# EAGLE schematic openmv-mp (EAGLE 9.1.2)
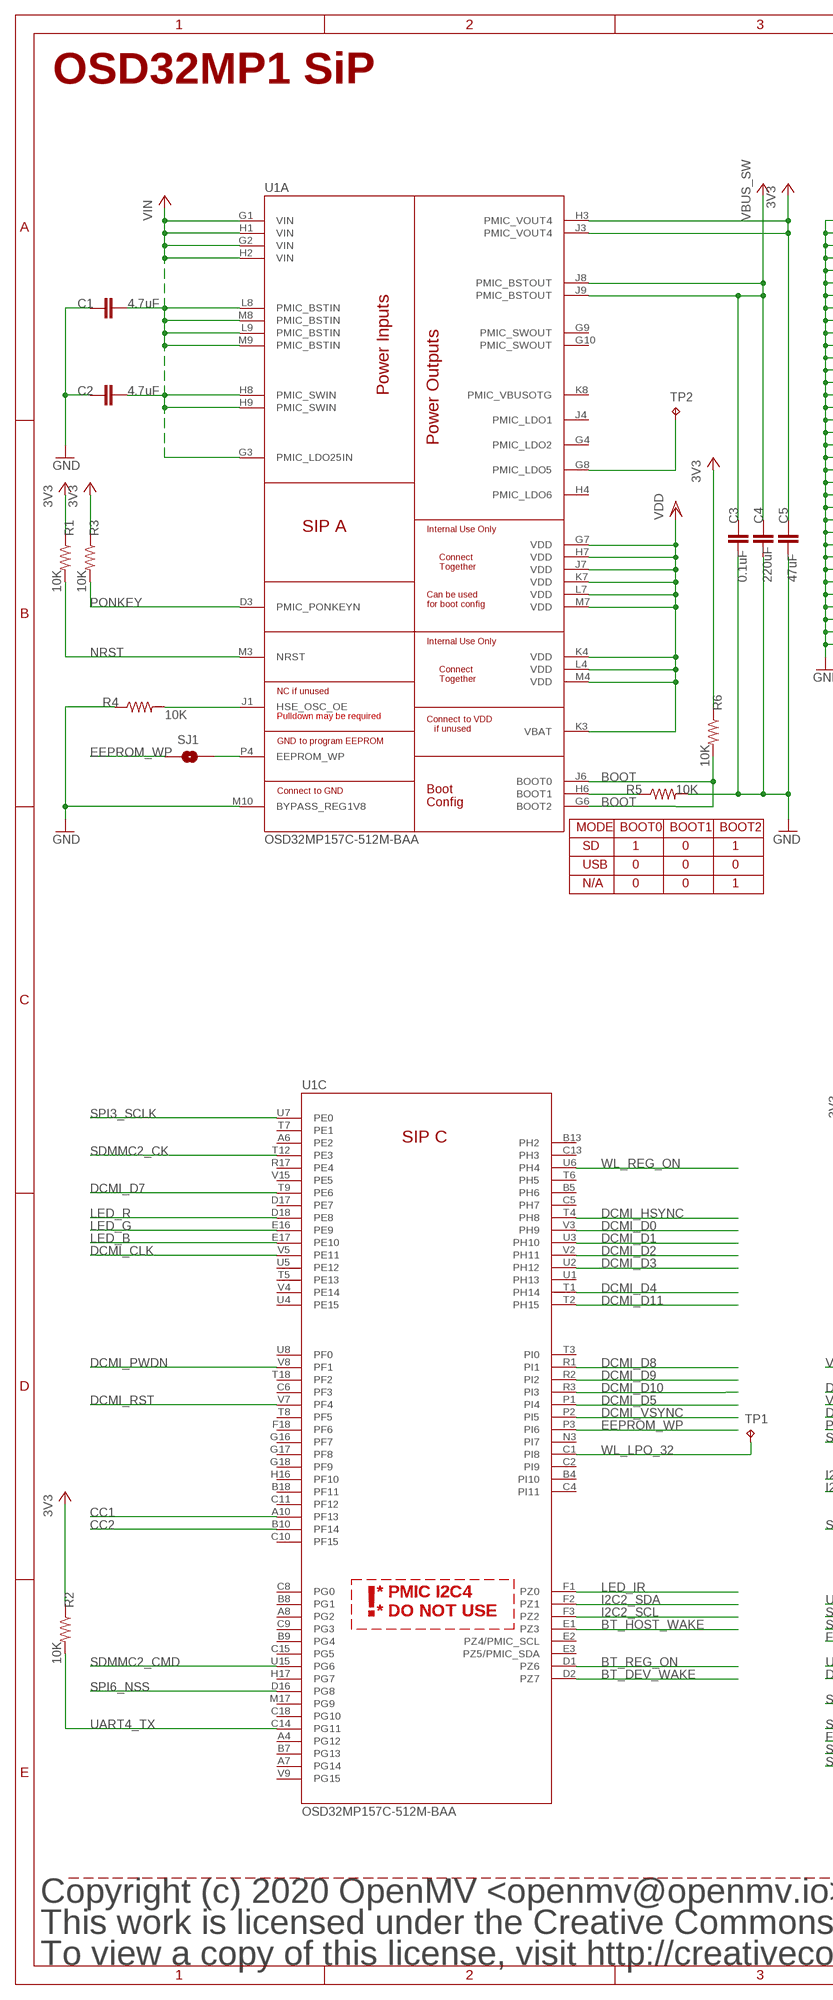
[diagram p0: schematic, sheet 1, part 1 of 2]
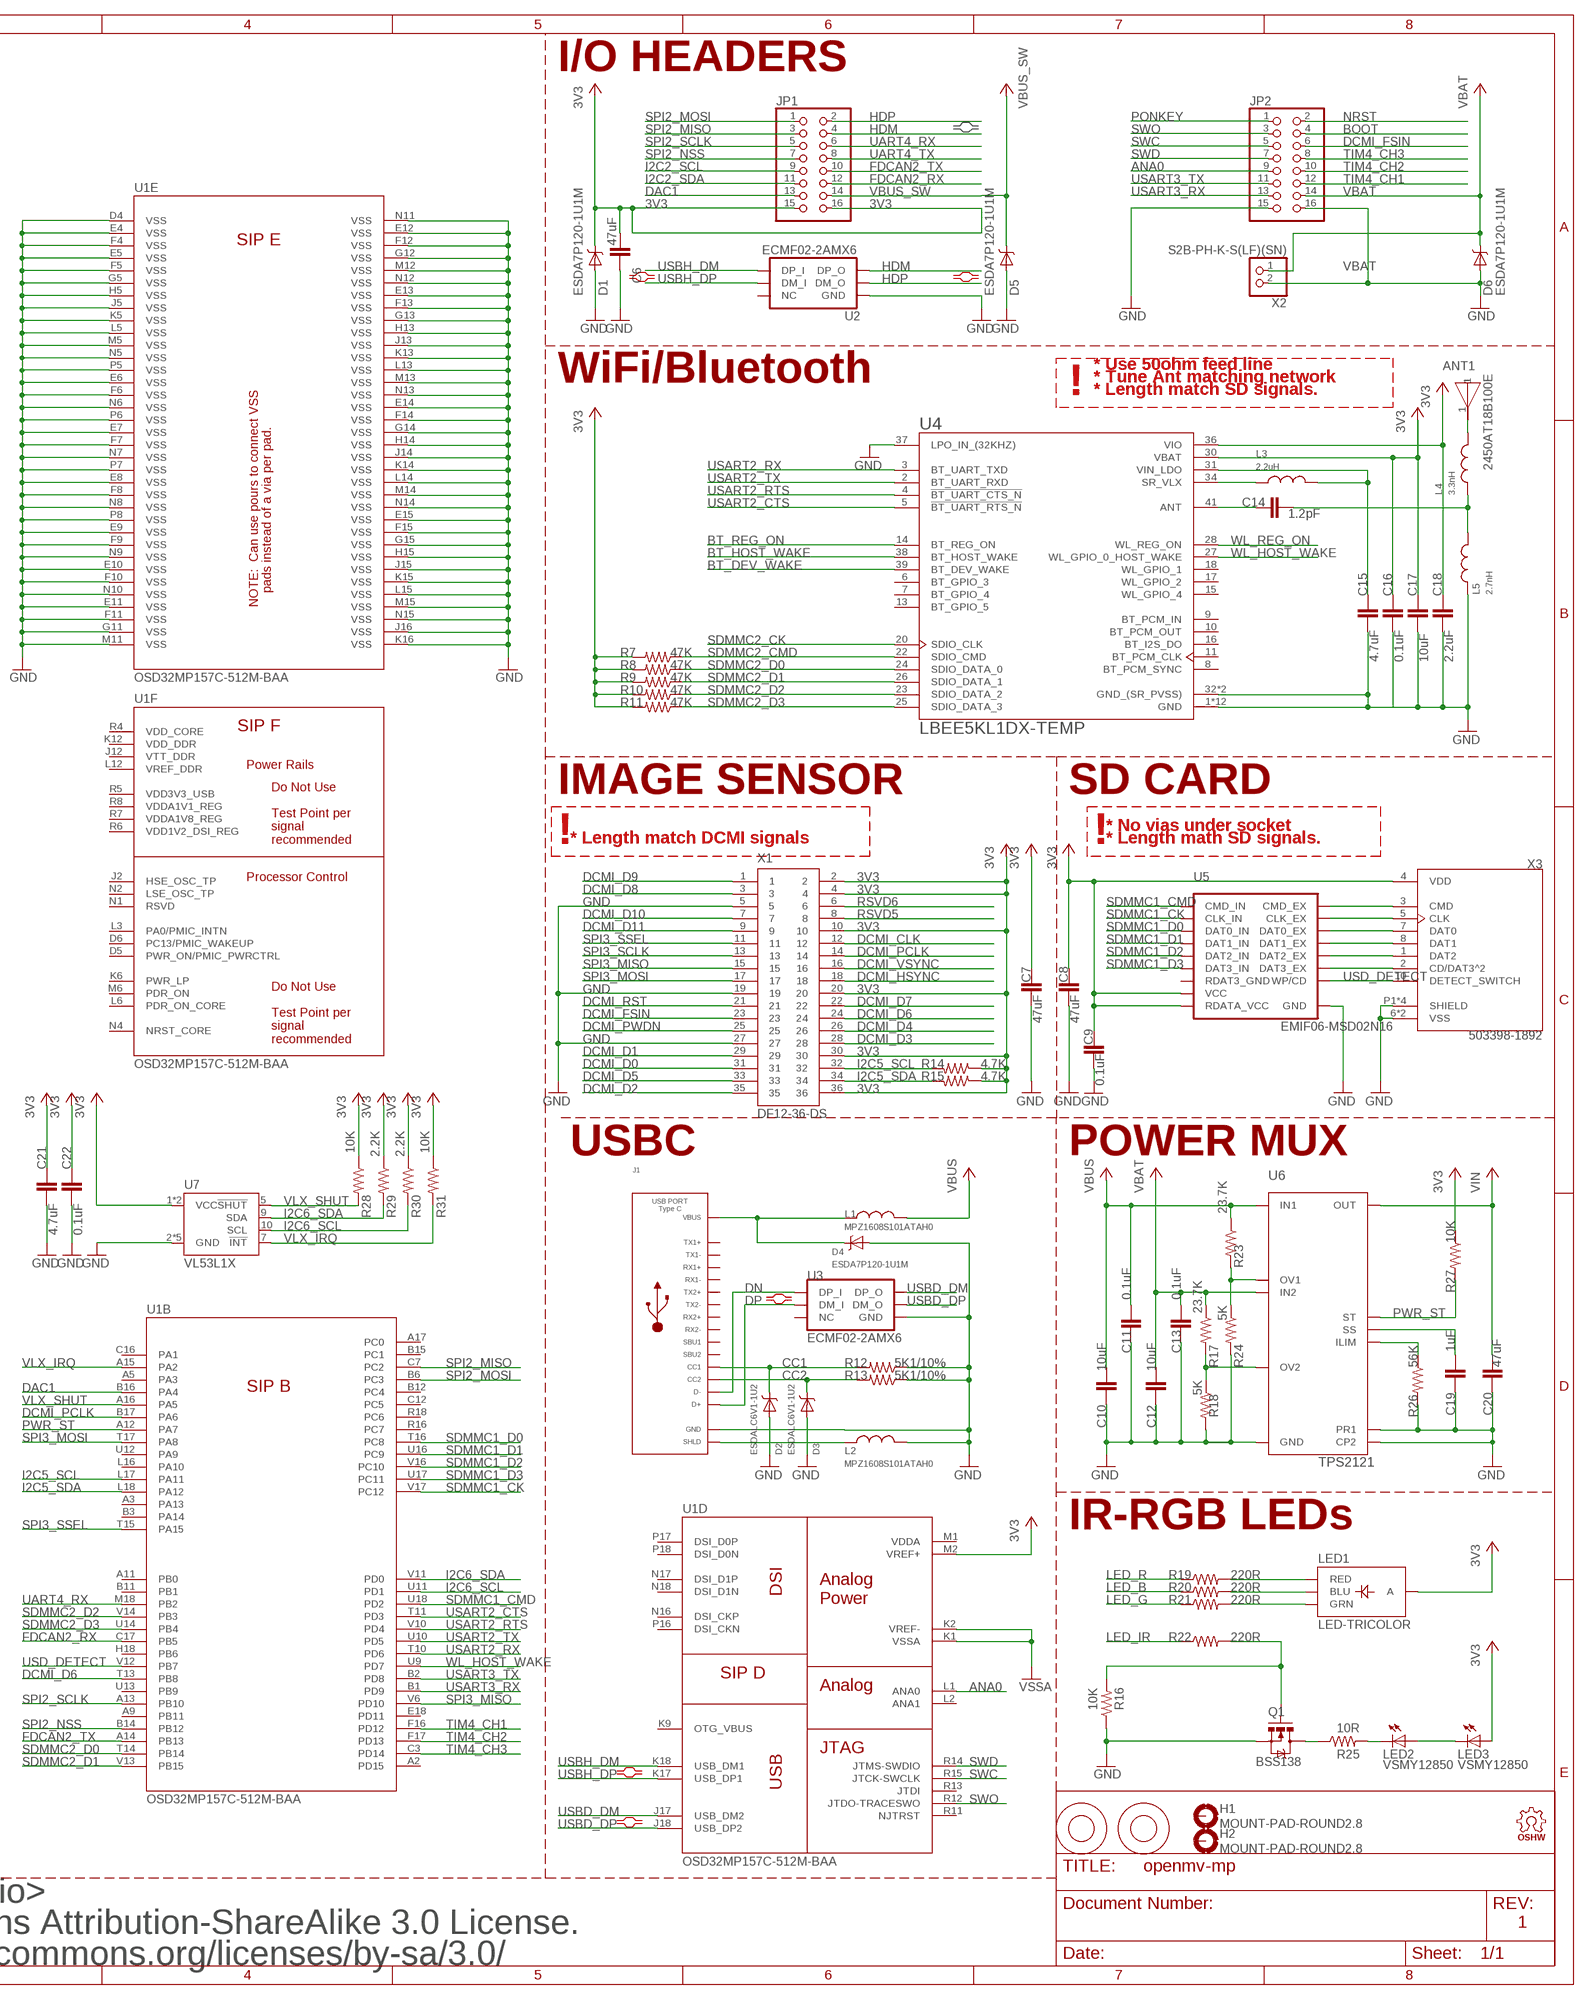
[diagram p1: schematic, sheet 1, part 2 of 2]

## Parts
ANT1  2450AT18B100E  [ANT_2450AT18B100E]
C1  4.7uF  CAP0402-CAP  [0402-CAP]
C2  4.7uF  CAP0402-CAP  [0402-CAP]
C3  0.1uF  CAP0402-CAP  [0402-CAP]
C4  220uF  CAP1206  [1206]
C5  47uF  CAP0805  [0805]
C6  47uF  CAP0805  [0805]
C7  47uF  CAP0805  [0805]
C8  47uF  CAP0805  [0805]
C9  0.1uF  CAP0402-CAP  [0402-CAP]
C10  10uF  CAP0402-CAP  [0402-CAP]
C11  0.1uF  CAP0402-CAP  [0402-CAP]
C12  10uF  CAP0402-CAP  [0402-CAP]
C13  0.1uF  CAP0402-CAP  [0402-CAP]
C14  1.2pF  CAP0402-CAP  [0402-CAP]
C15  4.7uF  CAP0402-CAP  [0402-CAP]
C16  0.1uF  CAP0402-CAP  [0402-CAP]
C17  10uF  CAP0402-CAP  [0402-CAP]
C18  2.2uF  CAP0402-CAP  [0402-CAP]
C19  1uF  CAP0402-CAP  [0402-CAP]
C20  47uF  CAP0805  [0805]
C21  4.7uF  CAP0402-CAP  [0402-CAP]
C22  0.1uF  CAP0402-CAP  [0402-CAP]
D1  ESDA7P120-1U1M  [ST0603]
D2  ESDALC6V1-1U2  [ST0201]
D3  ESDALC6V1-1U2  [ST0201]
D4  ESDA7P120-1U1M  [ST0603]
D5  ESDA7P120-1U1M  [ST0603]
D6  ESDA7P120-1U1M  [ST0603]
H1  MOUNT-PAD-ROUND2.8  [2,8-PAD]
H2  MOUNT-PAD-ROUND2.8  [2,8-PAD]
J1  USB_TYPE-C_105450-0101  [105450-0101]
JP1  PINHD-2X8  [2X08]
JP2  PINHD-2X8  [2X08]
L1  MPZ1608S101ATAH0  INDUCTOR0402  [C0402]
L2  MPZ1608S101ATAH0  INDUCTOR0402  [C0402]
L3  2.2uH  INDUCTOR0603  [0603]
L4  3.3nH  INDUCTOR0402  [C0402]
L5  2.7nH  INDUCTOR0402  [C0402]
LED1  LED-TRICOLOR  [LED-TRICOLOR-SMD-MF]
LED2  VSMY12850  LED1206  [LED-1206]
LED3  VSMY12850  LED1206  [LED-1206]
LOGO1  OSHW_LOGO_FILLX0100-NT  [OSHW_FILLX100_NOTEXT]
M1  9774030243R  9774030151R  [9774030151R]
M2  9774030243R  9774030151R  [9774030151R]
Q1  BSS138  MOSFET-NCHANNELSMD  [SOT23-3]
R1  10K  RESISTOR0402-RES  [0402-RES]
R2  10K  RESISTOR0402-RES  [0402-RES]
R3  10K  RESISTOR0402-RES  [0402-RES]
R4  10K  RESISTOR0402-RES  [0402-RES]
R5  10K  RESISTOR0402-RES  [0402-RES]
R6  10K  RESISTOR0402-RES  [0402-RES]
R7  47K  RESISTOR0402-RES  [0402-RES]
R8  47K  RESISTOR0402-RES  [0402-RES]
R9  47K  RESISTOR0402-RES  [0402-RES]
R10  47K  RESISTOR0402-RES  [0402-RES]
R11  47K  RESISTOR0402-RES  [0402-RES]
R12  5K1/10%  RESISTOR0402-RES  [0402-RES]
R13  5K1/10%  RESISTOR0402-RES  [0402-RES]
R14  4.7K  RESISTOR0402-RES  [0402-RES]
R15  4.7K  RESISTOR0402-RES  [0402-RES]
R16  10K  RESISTOR0402-RES  [0402-RES]
R17  23.7K  RESISTOR0402-RES  [0402-RES]
R18  5K  RESISTOR0402-RES  [0402-RES]
R19  220R  RESISTOR0402-RES  [0402-RES]
R20  220R  RESISTOR0402-RES  [0402-RES]
R21  220R  RESISTOR0402-RES  [0402-RES]
R22  220R  RESISTOR0402-RES  [0402-RES]
R23  23.7K  RESISTOR0402-RES  [0402-RES]
R24  5K  RESISTOR0402-RES  [0402-RES]
R25  10R  RESISTOR0402-RES  [0402-RES]
R26  56K  RESISTOR0402-RES  [0402-RES]
R27  10K  RESISTOR0402-RES  [0402-RES]
R28  10K  RESISTOR0402-RES  [0402-RES]
R29  2.2K  RESISTOR0402-RES  [0402-RES]
R30  2.2K  RESISTOR0402-RES  [0402-RES]
R31  10K  RESISTOR0402-RES  [0402-RES]
SJ1  SOLDERJUMPERNO  [SJ_2S-NO]
TP1  TPTP10R  [TP10R]
TP2  TPTP10R  [TP10R]
U1  OSD32MP157C-512M-BAA  [OSD32MP15X-BGA-324]
U2  ECMF02-2AMX6  [QFN-6L]
U3  ECMF02-2AMX6  [QFN-6L]
U4  LBEE5KL1DX-TEMP  [XCVR_LBEE5KL1DX-TEMP]
U5  EMIF06-MSD02N16  [QFN3.5]
U6  TPS2121  [VQFN-HR]
U7  VL53L1X  VL53L1XSMD  [VL53L1X]
X1  DF12-36-DS  [DF12-36-DS]
X2  S2B-PH-K-S(LF)(SN)  JST_2PIN-THM-RA  [JST-PH-2-THM-RA]
X3  503398-1892  [MOLEX_503398-1892]

## Nets
3V3: C5.1 C6.1 C7.1 C8.1 C9.1 C16.1 C17.1 C18.1 C21.1 C22.1 D1.1(C) JP1.15 JP1.16 LED1.A LED3.A R1.1 R2.1 R3.1 R6.1 R7.2 R8.2 R9.2 R10.2 R11.2 R14.1 R15.1 R27.1 R28.1 R29.1 R30.1 R31.1 U1.H3(A:PMIC_VOUT4) U1.J3(A:PMIC_VOUT4) U1.M2(D:VREF+) U4.30(VBAT) U4.36(VIO) U5.P$15(VCC) U5.P$16(RDATA_VCC) U7.1(VCC) U7.11(VCC) X1.2 X1.4 X1.10 X1.20 X1.30 X1.36 X3.4(VDD)
ANA0: JP2.9 U1.L1(D:ANA0)
BOOT: JP2.4 R6.2 U1.G6(A:BOOT2) U1.J6(A:BOOT0)
BT_DEV_WAKE: U1.D2(C:PZ7) U4.39(BT_DEV_WAKE)
BT_HOST_WAKE: U1.E1(C:PZ3) U4.38(BT_HOST_WAKE)
BT_REG_ON: U1.D1(C:PZ6) U4.14(BT_REG_ON)
CC1: D2.1(C) J1.A5(CC1) R12.2 U1.A10(C:PF13)
CC2: D3.1(C) J1.B5(CC2) R13.2 U1.B10(C:PF14)
DAC1: JP1.13 U1.B16(B:PA4)
DCMI_CLK: U1.V5(C:PE11) X1.12
DCMI_D0: U1.V3(C:PH9) X1.31
DCMI_D1: U1.U3(C:PH10) X1.29
DCMI_D2: U1.V2(C:PH11) X1.35
DCMI_D3: U1.U2(C:PH12) X1.28
DCMI_D4: U1.T1(C:PH14) X1.26
DCMI_D5: U1.P1(C:PI4) X1.33
DCMI_D6: U1.T13(B:PB8) X1.24
DCMI_D7: U1.T9(C:PE6) X1.22
DCMI_D8: U1.R1(C:PI1) X1.3
DCMI_D9: U1.R2(C:PI2) X1.1
DCMI_D10: U1.R3(C:PI3) X1.7
DCMI_D11: U1.T2(C:PH15) X1.9
DCMI_FSIN: JP2.6 X1.23
DCMI_HSYNC: U1.T4(C:PH8) X1.18
DCMI_PCLK: U1.B17(B:PA6) X1.14
DCMI_PWDN: U1.V8(C:PF1) X1.25
DCMI_RST: U1.V7(C:PF4) X1.21
DCMI_VSYNC: U1.P2(C:PI5) X1.16
DN: J1.A7(D-) J1.B7(D-) U3.1(DP_I)
DP: J1.A6(D+) J1.B6(D+) U3.2(DM_I)
EEPROM_WP: SJ1.1 U1.P3(C:PI6)
FDCAN2_RX: JP1.12 U1.C17(B:PB5)
FDCAN2_TX: JP1.10 U1.A14(B:PB13)
GND: C1.1 C2.1 C3.2 C4.2 C5.2 C6.2 C7.2 C8.2 C9.2 C10.2 C11.2 C12.2 C13.2 C15.2 C16.2 C17.2 C18.2 C19.2 C20.2 C21.2 C22.2 D1.2(A) D2.2(A) D3.2(A) D4.2(A) D5.2(A) D6.2(A) J1.A1(GND) J1.A12(GND) J1.B1(GND) J1.B12(GND) JP2.15 JP2.16 L2.2 L5.1 Q1.2(S) R4.1 R5.2 R12.1 R13.1 R16.1 R18.2 R24.2 R26.2 U1.D4(E:VSS) U1.E4(E:VSS) U1.E5(E:VSS) U1.E6(E:VSS) U1.E7(E:VSS) U1.E8(E:VSS) U1.E9(E:VSS) U1.E10(E:VSS) U1.E11(E:VSS) U1.E12(E:VSS) U1.E13(E:VSS) U1.E14(E:VSS) U1.E15(E:VSS) U1.F4(E:VSS) U1.F5(E:VSS) U1.F6(E:VSS) U1.F7(E:VSS) U1.F8(E:VSS) U1.F9(E:VSS) U1.F10(E:VSS) U1.F11(E:VSS) U1.F12(E:VSS) U1.F13(E:VSS) U1.F14(E:VSS) U1.F15(E:VSS) U1.G5(E:VSS) U1.G11(E:VSS) U1.G12(E:VSS) U1.G13(E:VSS) U1.G14(E:VSS) U1.G15(E:VSS) U1.H5(E:VSS) U1.H13(E:VSS) U1.H14(E:VSS) U1.H15(E:VSS) U1.J5(E:VSS) U1.J13(E:VSS) U1.J14(E:VSS) U1.J15(E:VSS) U1.J16(E:VSS) U1.K5(E:VSS) U1.K13(E:VSS) U1.K14(E:VSS) U1.K15(E:VSS) U1.K16(E:VSS) U1.L5(E:VSS) U1.L13(E:VSS) U1.L14(E:VSS) U1.L15(E:VSS) U1.M5(E:VSS) U1.M10(A:BYPASS_REG1V8) U1.M11(E:VSS) U1.M12(E:VSS) U1.M13(E:VSS) U1.M14(E:VSS) U1.M15(E:VSS) U1.N5(E:VSS) U1.N6(E:VSS) U1.N7(E:VSS) U1.N8(E:VSS) U1.N9(E:VSS) U1.N10(E:VSS) U1.N11(E:VSS) U1.N12(E:VSS) U1.N13(E:VSS) U1.N14(E:VSS) U1.N15(E:VSS) U1.P5(E:VSS) U1.P6(E:VSS) U1.P7(E:VSS) U1.P8(E:VSS) U2.3(GND) U3.3(GND) U4.1(GND) U4.12(GND) U4.19(GND) U4.21(GND) U4.29(GND) U4.32(GND_(SR_PVSS)) U4.33(GND_(SR_PVSS)) U4.35(GND) U4.37(LPO_IN_(32KHZ)) U4.40(GND) U4.42(GND) U4.43(GND) U4.44(GND) U4.45(GND) U4.46(GND) U5.GND U6.P$3(CP2) U6.P$6(PR1) U6.P$12(GND) U7.2(GND) U7.3(GND) U7.4(GND) U7.6(GND) U7.12(GND) X1.5 X1.19 X1.27 X2.2 X3.6(VSS) X3.9(VSS) X3.P1(SHIELD) X3.P2(SHIELD) X3.P3(SHIELD) X3.P4(SHIELD)
HDM: JP1.4 U2.6(DP_O)
HDP: JP1.2 U2.5(DM_O)
I2C2_SCL: JP1.9 U1.F3(C:PZ2)
I2C2_SDA: JP1.11 U1.F2(C:PZ1)
I2C5_SCL: R14.2 U1.L17(B:PA11) X1.32
I2C5_SDA: R15.2 U1.L18(B:PA12) X1.34
I2C6_SCL: R30.2 U1.U11(B:PD1) U7.10(SCL)
I2C6_SDA: R29.2 U1.V11(B:PD0) U7.9(SDA)
LED_B: R20.1 U1.E17(C:PE10)
LED_G: R21.1 U1.E16(C:PE9)
LED_IR: R22.1 U1.F1(C:PZ0)
LED_R: R19.1 U1.D18(C:PE8)
N$2: R4.2 U1.J1(A:HSE_OSC_OE)
N$4: J1.S_T1(SHLD) J1.S_T2(SHLD) J1.S_T3(SHLD) J1.S_T4(SHLD) L2.1
N$5: Q1.1(G) R16.2 R22.2
N$6: LED1.B(BLU) R20.2
N$7: SJ1.2 U1.P4(A:EEPROM_WP)
N$8: LED1.R(RED) R19.2
N$9: LED1.G(GRN) R21.2
N$10: LED2.C R25.2
N$11: TP2.TP U1.G8(A:PMIC_LDO5)
N$12: U5.P$13(DAT3_EX) X3.2(CD/DAT3^2)
N$13: U5.P$14(DAT2_EX) X3.1(DAT2)
N$14: Q1.3(D) R25.1
N$17: LED2.A LED3.C
N$30: U5.P$9(DAT1_EX) X3.8(DAT1)
N$31: U5.P$10(DAT0_EX) X3.7(DAT0)
N$32: U5.P$11(CLK_EX) X3.5(CLK)
N$33: U5.P$12(CMD_EX) X3.3(CMD)
N$34: D4.1(C) J1.A4(VBUS) J1.A9(VBUS) J1.B4(VBUS) J1.B9(VBUS) L1.1
N$36: R5.1 U1.H6(A:BOOT1)
N$39: R23.2 R24.1 U6.P$5(OV1)
N$40: C19.1 U6.P$11(SS)
N$41: R17.2 R18.1 U6.P$4(OV2)
N$42: R26.1 U6.P$10(ILIM)
N$44: C14.1 L4.1 L5.2
N$45: ANT1.1 L4.2
N$46: C14.2 U4.41(ANT)
N$47: C15.1 L3.2 U4.31(VIN_LDO)
N$48: L3.1 U4.34(SR_VLX)
NRST: JP2.2 R1.2 U1.M3(A:NRST)
PONKEY: JP2.1 R3.2 U1.D3(A:PMIC_PONKEYN)
PWR_ST: R27.2 U1.A12(B:PA7) U6.P$9(ST)
RSVD5: X1.8
RSVD6: X1.6
SDMMC1_CK: U1.V17(B:PC12) U5.P$6(CLK_IN)
SDMMC1_CMD: U1.U18(B:PD2) U5.P$5(CMD_IN)
SDMMC1_D0: U1.T16(B:PC8) U5.P$7(DAT0_IN)
SDMMC1_D1: U1.U16(B:PC9) U5.P$8(DAT1_IN)
SDMMC1_D2: U1.V16(B:PC10) U5.P$3(DAT2_IN)
SDMMC1_D3: U1.U17(B:PC11) U5.P$4(DAT3_IN)
SDMMC2_CK: U1.T12(C:PE3) U4.20(SDIO_CLK)
SDMMC2_CMD: R7.1 U1.U15(C:PG6) U4.22(SDIO_CMD)
SDMMC2_D0: R8.1 U1.T14(B:PB14) U4.24(SDIO_DATA_0)
SDMMC2_D1: R9.1 U1.V13(B:PB15) U4.26(SDIO_DATA_1)
SDMMC2_D2: R10.1 U1.V14(B:PB3) U4.23(SDIO_DATA_2)
SDMMC2_D3: R11.1 U1.U14(B:PB4) U4.25(SDIO_DATA_3)
SPI2_MISO: JP1.3 U1.C7(B:PC2)
SPI2_MOSI: JP1.1 U1.B6(B:PC3)
SPI2_NSS: JP1.7 U1.B14(B:PB12)
SPI2_SCLK: JP1.5 U1.A13(B:PB10)
SPI3_MISO: U1.V6(B:PD10) X1.15
SPI3_MOSI: U1.T17(B:PA8) X1.17
SPI3_SCLK: U1.U7(C:PE0) X1.13
SPI3_SSEL: U1.T15(B:PA15) X1.11
SPI6_NSS: U1.D16(C:PG8)
SWC: JP2.5 U1.R15(D:JTCK-SWCLK)
SWD: JP2.7 U1.R14(D:JTMS-SWDIO)
SWO: JP2.3 U1.R12(D:JTDO-TRACESWO)
TIM4_CH1: JP2.12 U1.F16(B:PD12)
TIM4_CH2: JP2.10 U1.F17(B:PD13)
TIM4_CH3: JP2.8 U1.C3(B:PD14)
UART4_RX: JP1.6 U1.M18(B:PB2)
UART4_TX: JP1.8 R2.2 U1.C14(C:PG11)
USART2_CTS: U1.T11(B:PD3) U4.5(!BT_UART_RTS_N)
USART2_RTS: U1.V10(B:PD4) U4.4(!BT_UART_CTS_N)
USART2_RX: U1.T10(B:PD6) U4.3(BT_UART_TXD)
USART2_TX: U1.U10(B:PD5) U4.2(BT_UART_RXD)
USART3_RX: JP2.13 U1.B1(B:PD9)
USART3_TX: JP2.11 U1.B2(B:PD8)
USBD_DM: U1.J17(D:USB_DM2) U3.6(DP_O)
USBD_DP: U1.J18(D:USB_DP2) U3.5(DM_O)
USBH_DM: U1.K18(D:USB_DM1) U2.1(DP_I)
USBH_DP: U1.K17(D:USB_DP1) U2.2(DM_I)
USD_DETECT: U1.V12(B:PB7) U5.P$1(WP/CD) X3.10(DETECT_SWITCH)
VBAT: C12.1 C13.1 D6.1(C) JP2.14 R17.1 U6.P$2(IN2) X2.1
VBUS: C10.1 C11.1 L1.2 R23.1 U6.P$7(IN1)
VBUS_SW: C3.1 C4.1 D5.1(C) JP1.14 U1.J8(A:PMIC_BSTOUT) U1.J9(A:PMIC_BSTOUT)
VDD: U1.G7(A:VDD) U1.H7(A:VDD) U1.J7(A:VDD) U1.K3(A:VBAT) U1.K4(A:VDD) U1.K7(A:VDD) U1.L4(A:VDD) U1.L7(A:VDD) U1.M4(A:VDD) U1.M7(A:VDD)
VIN: C1.2 C2.2 C20.1 U1.G1(A:VIN) U1.G2(A:VIN) U1.G3(A:PMIC_LDO25IN) U1.H1(A:VIN) U1.H2(A:VIN) U1.H8(A:PMIC_SWIN) U1.H9(A:PMIC_SWIN) U1.L8(A:PMIC_BSTIN) U1.L9(A:PMIC_BSTIN) U1.M8(A:PMIC_BSTIN) U1.M9(A:PMIC_BSTIN) U6.P$1(OUT) U6.P$8(OUT)
VLX_IRQ: R31.2 U1.A15(B:PA2) U7.7(!INT)
VLX_SHUT: R28.2 U1.A16(B:PA5) U7.5(!SHUT)
VSSA: U1.K1(D:VSSA) U1.K2(D:VREF-)
WL_HOST_WAKE: U1.U9(B:PD7) U4.27(WL_GPIO_0_HOST_WAKE)
WL_LPO_32: TP1.TP U1.C1(C:PI8)
WL_REG_ON: U1.U6(C:PH4) U4.28(WL_REG_ON)
Unconnected: H1.B2,8(MOUNT) H2.B2,8(MOUNT) J1.A2(TX1+) J1.A3(TX1-) J1.A8(SBU1) J1.A10(RX2-) J1.A11(RX2+) J1.B2(TX2+) J1.B3(TX2-) J1.B8(SBU2) J1.B10(RX1-) J1.B11(RX1+) U1.A2(B:PD15) U1.A3(B:PA13) U1.A4(C:PG12) U1.A5(B:PA3) U1.A6(C:PE2) U1.A7(C:PG14) U1.A8(C:PG2) U1.A9(B:PB11) U1.A11(B:PB0) U1.A17(B:PC0) U1.B3(B:PA14) U1.B4(C:PI10) U1.B5(C:PH6) U1.B7(C:PG13) U1.B8(C:PG1) U1.B9(C:PG4) U1.B11(B:PB1) U1.B12(B:PC4) U1.B13(C:PH2) U1.B15(B:PC1) U1.B18(C:PF11) U1.C2(C:PI9) U1.C4(C:PI11) U1.C5(C:PH7) U1.C6(C:PF3) U1.C8(C:PG0) U1.C9(C:PG3) U1.C10(C:PF15) U1.C11(C:PF12) U1.C12(B:PC5) U1.C13(C:PH3) U1.C15(C:PG5) U1.C16(B:PA1) U1.C18(C:PG10) U1.D5(F:PWR_ON/PMIC_PWRCTRL) U1.D6(F:PC13/PMIC_WAKEUP) U1.D7(G:RSVD) U1.D8(G:RSVD) U1.D9(G:RSVD) U1.D10(G:RSVD) U1.D17(C:PE7) U1.E2(C:PZ4/PMIC_SCL) U1.E3(C:PZ5/PMIC_SDA) U1.E18(B:PD11) U1.F18(C:PF6) U1.G4(A:PMIC_LDO2) U1.G9(A:PMIC_SWOUT) U1.G10(A:PMIC_SWOUT) U1.G16(C:PF7) U1.G17(C:PF8) U1.G18(C:PF9) U1.H4(A:PMIC_LDO6) U1.H12(G:RSVD) U1.H16(C:PF10) U1.H17(C:PG7) U1.H18(B:PB6) U1.J2(F:HSE_OSC_TP) U1.J4(A:PMIC_LDO1) U1.J12(F:VTT_DDR) U1.K6(F:PWR_LP) U1.K8(A:PMIC_VBUSOTG) U1.K9(D:OTG_VBUS) U1.K12(F:VDD_DDR) U1.L2(D:ANA1) U1.L3(F:PA0/PMIC_INTN) U1.L6(F:PDR_ON_CORE) U1.L12(F:VREF_DDR) U1.L16(B:PA10) U1.M1(D:VDDA) U1.M6(F:PDR_ON) U1.M16(G:RSVD) U1.M17(C:PG9) U1.N1(F:RSVD) U1.N2(F:LSE_OSC_TP) U1.N3(C:PI7) U1.N4(F:NRST_CORE) U1.N16(D:DSI_CKP) U1.N17(D:DSI_D1P) U1.N18(D:DSI_D1N) U1.P9(G:RSVD) U1.P10(G:RSVD) U1.P16(D:DSI_CKN) U1.P17(D:DSI_D0P) U1.P18(D:DSI_D0N) U1.R4(F:VDD_CORE) U1.R5(F:VDD3V3_USB) U1.R6(F:VDD1V2_DSI_REG) U1.R7(F:VDDA1V8_REG) U1.R8(F:VDDA1V1_REG) U1.R9(G:RSVD) U1.R10(G:RSVD) U1.R11(D:NJTRST) U1.R13(D:JTDI) U1.R16(B:PC7) U1.R17(C:PE4) U1.R18(B:PC6) U1.T3(C:PI0) U1.T5(C:PE13) U1.T6(C:PH5) U1.T7(C:PE1) U1.T8(C:PF5) U1.T18(C:PF2) U1.U1(C:PH13) U1.U4(C:PE15) U1.U5(C:PE12) U1.U8(C:PF0) U1.U12(B:PA9) U1.U13(B:PB9) U1.V4(C:PE14) U1.V9(C:PG15) U1.V15(C:PE5) U2.4(NC) U3.4(NC) U4.6(BT_GPIO_3) U4.7(BT_GPIO_4) U4.8(BT_PCM_SYNC) U4.9(BT_PCM_IN) U4.10(BT_PCM_OUT) U4.11(BT_PCM_CLK) U4.13(BT_GPIO_5) U4.15(WL_GPIO_4) U4.16(BT_I2S_DO) U4.17(WL_GPIO_2) U4.18(WL_GPIO_1) U5.P$2(RDAT3_GND)

## Notes on the sheet
- OSD32MP1 SiP | I/O HEADERS
- * Use 50ohm feed line
- WiFi/Bluetooth | ! | * Tune Ant matching network
- * Length match SD signals.
- Pulldown may be required
- IMAGE SENSOR | SD CARD
- MODE | BOOT0 | BOOT1 | BOOT2 | * No vias under socket
- ! | * Length match DCMI signals | ! | * Length math SD signals.
- SD | 1 | 0 | 1
- USB | 0 | 0 | 0
- N/A | 0 | 0 | 1
- USBC | POWER MUX
- IR-RGB LEDs
- !
- * PMIC I2C4
  * DO NOT USE
- Copyright (c) 2020 OpenMV <openmv@openmv.io>
- 1
- This work is licensed under the Creative Commons Attribution-ShareAlike 3.0 License.
- To view a copy of this license, visit http://creativecommons.org/licenses/by-sa/3.0/

## Library data of the parts
ANT1 = 2450AT18B100E:2450AT18B100E: ANTENNA, CERAMIC, 2.45GHZ; Bandwidth: 100MHz; Frequency: 2.45GHz; Gain: -0.5dB; Impedance: 50ohm http://www.snapeda.com/parts/2450AT18B100E/Johanson/view-part/#; AVAILABILITY: Unavailable; DESCRIPTION: 2.4GHz Chip RF Antenna 2.4GHz ~ 2.5GHz 0.5dBi Solder Surface Mount; MF: Johanson Technology; MP: 2450AT18B100E; PACKAGE: None; PRICE: None
C1-C22 = sfe:CAP: Capacitor Standard 0603 ceramic capacitor, and 0.1" leaded capacitor.
D1 D4-D6 = esd:ESDA7P120-1U1M
D2 D3 = esd:ESDALC6V1-1U2
H1 H2 = holes:MOUNT-PAD-ROUND: MOUNTING PAD, round
J1 = PP_Connectors:USB_TYPE-C; POPULATE: 1
JP1 JP2 = pinhead:PINHD-2X8: PIN HEADER
L1-L5 = sfe:INDUCTOR: Inductors Basic Inductor/Choke - 0603 and 1206. Footprints are not proven and vary greatly between part numbers.
LED1 = sfe:LED-TRICOLOR: Tri-Color LED SMD Proven layout and schematic for triple color LED in SMD package - common anode. Spark Fun Electronics SKU : COM-07844
LED2 LED3 = sfe:LED: LEDs Standard schematic elements and footprints for 5mm, 3mm, 1206, and 0603 sized LEDs. 5mm - Spark Fun Electronics SKU : COM-00529 (and others)
LOGO1 = iofault:OSHW_LOGO_FILL
M1 M2 = STANDOFFS:9774030151R
Q1 = sfe:MOSFET-NCHANNEL
R1-R31 = sfe:RESISTOR: Resistor Basic schematic elements and footprints for 0603, 1206, and PTH resistors.
SJ1 = sfe:SOLDERJUMPER: Solder Jumper Standard SMD solder jumper. Used to automate production. Two varients : Normally Open and Normally Closed are the same, but have different paste layers. NC will have a large amount of paste and should jumper during reflow.
TP1 TP2 = testpad:TP: Test pad
U1 = Octavo-Systems:OSD32MP157C-512M-BAA: Octavo Systems LLC OSD32MP15x Family SiP: 18mm x 18mm, 1mm pitch 302 pin BGA contains STM32MP157C, 512MB DDR3, STPMIC1A, 4kB EEPROM, MEMS oscillators (24MHz and 32kHz) and passives. Commerical Temperature (case): 0C to 85C.
U2 U3 = esd:ECMF02-2AMX6
U4 = LBEE5KL1DX-TEMP:LBEE5KL1DX-TEMP: Broadcom Chipset for 802.11b/g/n + Bluetooth 4.1/EDR; AVAILABILITY: Unavailable; DESCRIPTION: WICED Transceiver; 802.11 b/g/n _Wi-Fi, WiFi, WLAN_, Bluetooth® Smart Ready 4.x Dual Mode For Use With BCM4343W, i.MX 6; MF: Murata Electronics; MP: LBEE5KL1DX-TEMP; PACKAGE: None; PRICE: None
U5 = esd:EMIF06-MSD02N16
U6 = mux:TPS2121
U7 = SparkFun-Sensors:VL53L1X: STMicroelectronics VL53L1X - 400 cm IR Laser ToF Sensor VL53L1X is a state-of-the-art ToF laser-ranging sensor, enhancing the ST FlightSense product family. It is the fastest miniature ToF sensor currently on the market with accurate ranging up to 4 m and fast ranging frequency (up to 50 Hz). Housed in a miniature and reflowable package, it integrates a single photon avalanche diode (SPAD) receiving array, a 940 nm invisible laser Class 1 emitter, physical infrared filters, and optics to achieve the best ranging performance in various ambient lighting conditions with a range of cover window options.; PROD_ID: IC-13960
X1 = DF12:DF12-36-DS
X2 = adafruit-updated:JST_2PIN: JST 2-Pin Connectors of various flavors SMT-RA (S2B-PH-SM4) 4UConnector #17311 SMT (B2B-PH-SM4) THM-RA (S2B-PH) THM (B2B-PH)
X3 = 503398-1892:503398-1892: 1.10mm Pitch microSD Memory Card Connector, Normal Mount Surface Mount, Push-Push Type, 1.28mm Height; AVAILABILITY: Good; DESCRIPTION: 1.10mm Pitch microSD Memory Card Connector, Normal Mount Surface Mount, Push-Push Type, 1.28mm Height; MF: Molex; MP: 5033981892; PACKAGE: None; PRICE: 1.67 USD